# Altium project UNIREL_POT.PrjPcb
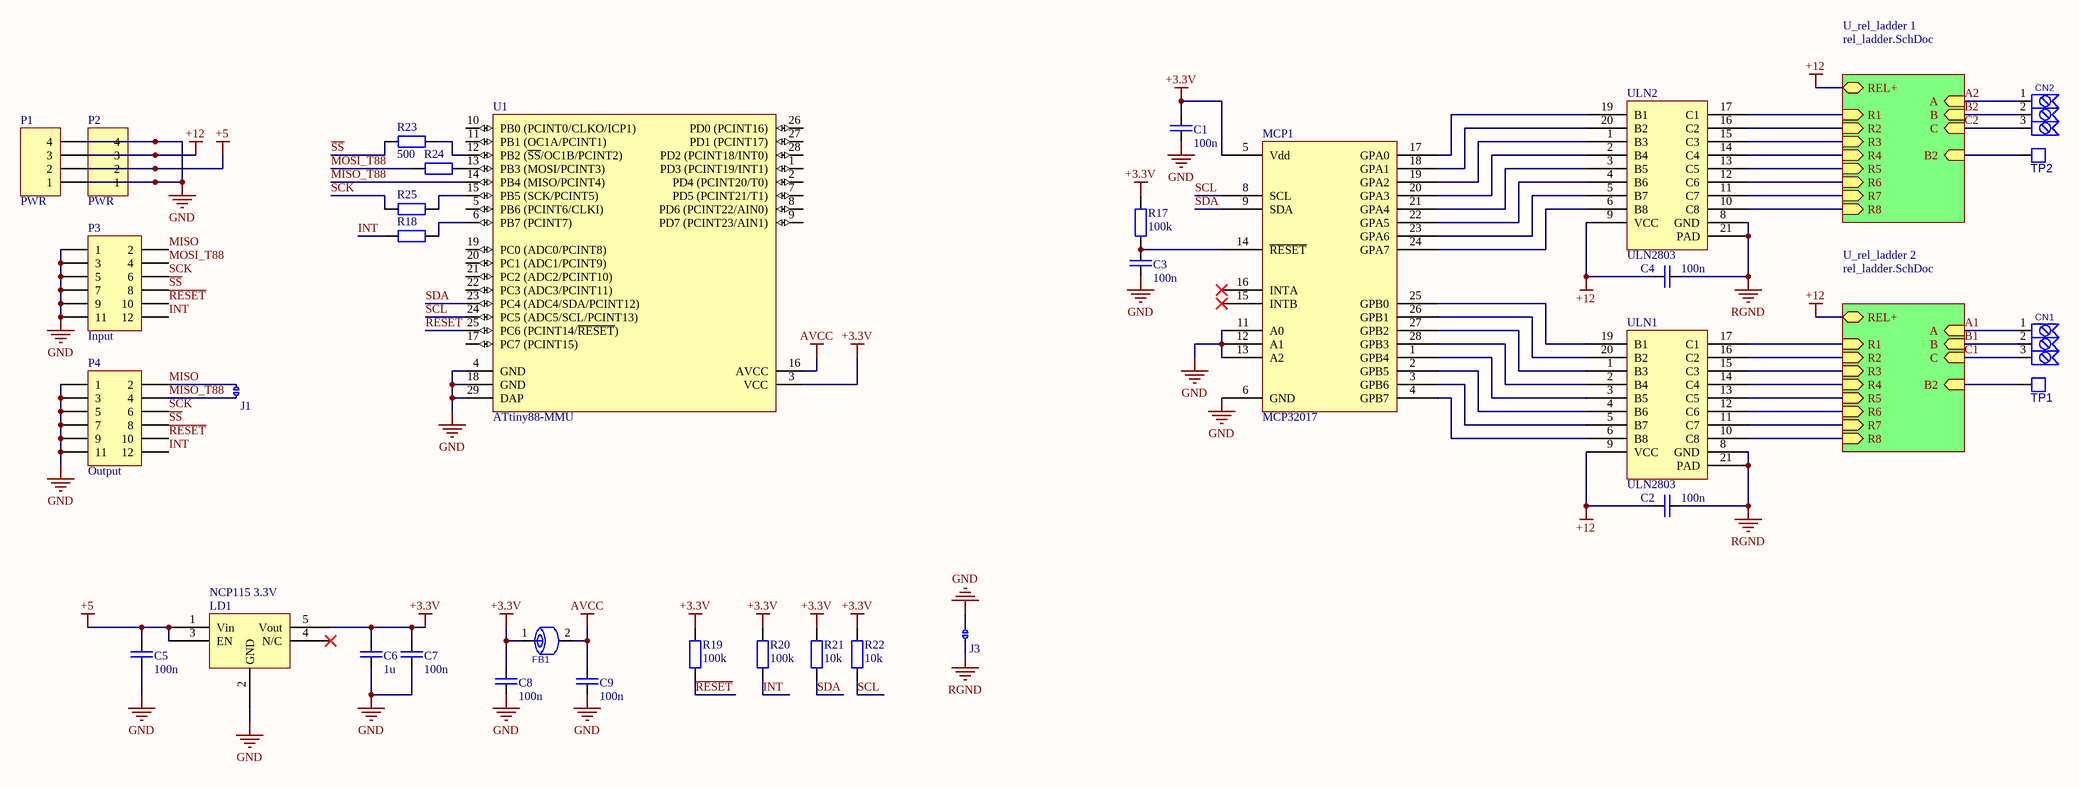
[diagram p0: POT 2x8.SchDoc]
3 sheets, 409 parts. Net scope: hierarchical (ports join the sheet entries above them; power ports are global).
Board files: POT 2x8.PcbDoc, POT 10x8.PcbDoc
Sheets:
  POT 2x8.SchDoc
    U_rel_ladder 1 = rel_ladder.SchDoc
    U_rel_ladder 2 = rel_ladder.SchDoc
  POT 10x8.SchDoc
    U_rel_ladder1 = rel_ladder.SchDoc
    U_rel_ladder2 = rel_ladder.SchDoc
    U_rel_ladder3 = rel_ladder.SchDoc
    U_rel_ladder4 = rel_ladder.SchDoc
    U_rel_ladder5 = rel_ladder.SchDoc
    U_rel_ladder6 = rel_ladder.SchDoc
    U_rel_ladder7 = rel_ladder.SchDoc
    U_rel_ladder8 = rel_ladder.SchDoc
    U_rel_ladder9 = rel_ladder.SchDoc
    U_rel_ladder10 = rel_ladder.SchDoc

## Sheet POT 2x8.SchDoc
size C

### Parts
C1  100n  [R1005_0402i_L]
C2  100n  [R1005_0402i_L]
C3  100n  [R1005_0402i_L]
C4  100n  [R1005_0402i_L]
C5  100n  [R1005_0402i_L]
C6  1u  [C1608_0603I_L]
C7  100n  [R1005_0402i_L]
C8  100n  [R1005_0402i_L]
C9  100n  [R1005_0402i_L]
CN1  VRSTNA SPONKA 3P/16A  [VRSTNA SPONKA 3P/16A]  (value not drawn)
CN2  VRSTNA SPONKA 3P/16A  [VRSTNA SPONKA 3P/16A]  (value not drawn)
FB1  FERITTE BEAD  [R1608_0603I_L]  (value not drawn)
J1  Terminator  [solderJumper]  (value not drawn)
J3  JMP_mini  [solderJumper]  (value not drawn)
LD1  NCP115 3.3V  [TSOP95P280X110-6L]
MCP1  MCP32017  [MCP23017 QFN]
P1  PWR  [HDR1X4]
P2  PWR  [HDR1X4]
P3  Input  [1.27mm SMD conn]
P4  Output  [1.27mm SMD conn]
R17  100k  [R1005_0402i_L]
R18  500  [R1005_0402i_L]  (value not drawn)
R19  100k  [R1005_0402i_L]
R20  100k  [R1005_0402i_L]
R21  10k  [R1005_0402i_L]
R22  10k  [R1005_0402i_L]
R23  500  [R1005_0402i_L]
R24  500  [R1005_0402i_L]  (value not drawn)
R25  500  [R1005_0402i_L]  (value not drawn)
TP1  PAD  [PAD_CIRC_HOLE]  (value not drawn)
TP2  PAD  [PAD_CIRC_HOLE]  (value not drawn)
U1  ATtiny88-MMU  [28M1_N]
ULN1  ULN2803  [QFN127P600-8N]
ULN2  ULN2803  [QFN127P600-8N]

### Sub-sheets
U_rel_ladder 1 = rel_ladder.SchDoc: B (in), C (in), A (in), REL+ (bidir), R1 (in), R2 (in), R3 (in), R4 (in), R5 (in), R6 (in), R7 (in), R8 (in), B2 (in)
U_rel_ladder 2 = rel_ladder.SchDoc: B (in), C (in), A (in), REL+ (bidir), R1 (in), R2 (in), R3 (in), R4 (in), R5 (in), R6 (in), R7 (in), R8 (in), B2 (in)

### Nets
+3.3V: C1.2 C6.1 C7.1 C8.1 FB1.1 LD1.5(Vout) MCP1.5(Vdd) R17.1 R19.1 R20.1 R21.1 R22.1 U1.3(VCC)
+5: C5.1 LD1.1(Vin) LD1.3(EN) P1.2 P2.2
+12: C2.1 C4.1 P1.3 P2.3 ULN1.9(VCC) ULN2.9(VCC) ; sheet U_rel_ladder 1/REL+, sheet U_rel_ladder 2/REL+
AVCC: C9.1 FB1.2 U1.16(AVCC)
GND: C1.1 C2.2 C3.1 C4.2 C5.2 C6.2 C7.2 C8.2 C9.2 J3.1 J3.2 LD1.2(GND) MCP1.6(GND) MCP1.11(A0) MCP1.12(A1) MCP1.13(A2) P1.1 P1.4 P2.1 P2.4 P3.1 P3.3 P3.5 P3.7 P3.9 P3.11 P4.1 P4.3 P4.5 P4.7 P4.9 P4.11 U1.4(GND) U1.18(GND) U1.29(DAP) ULN1.8(GND) ULN1.21(PAD) ULN2.8(GND) ULN2.21(PAD)  [also labelled RGND]
A1: CN1.1 ; sheet U_rel_ladder 2/A
A2: CN2.1 ; sheet U_rel_ladder 1/A
B1: CN1.2 TP1.1 ; sheet U_rel_ladder 2/B, sheet U_rel_ladder 2/B2
B2: CN2.2 TP2.1 ; sheet U_rel_ladder 1/B, sheet U_rel_ladder 1/B2
C1: CN1.3 ; sheet U_rel_ladder 2/C
C2: CN2.3 ; sheet U_rel_ladder 1/C
INT: P3.12 P4.12 R18.1 R20.2
MISO: J1.2 P3.2 P4.2
MISO_T88: J1.1 P4.4 U1.14(PB4_(MISO/PCINT4))
MOSI_T88: P3.4 R24.1
~{RESET}: P3.10 P4.10 R19.2 U1.25(PC6_(PCINT14/~{RESET}))
~{SS}: P3.8 P4.8 R23.1
SCK: P3.6 P4.6 R25.1
SCL: MCP1.8(SCL) R22.2 U1.24(PC5_(ADC5/SCL/PCINT13))
SDA: MCP1.9(SDA) R21.2 U1.23(PC4_(ADC4/SDA/PCINT12))
NetC3_2: C3.2 MCP1.14(~{RESET}) R17.2
NetK1_U_rel_ladder8_8: ULN1.17(C1) ; sheet U_rel_ladder 2/R1
NetK1_U_rel_ladder10#1_8: ULN2.17(C1) ; sheet U_rel_ladder 1/R1
NetK2_U_rel_ladder8_8: ULN1.16(C2) ; sheet U_rel_ladder 2/R2
NetK2_U_rel_ladder10#1_8: ULN2.16(C2) ; sheet U_rel_ladder 1/R2
NetK3_U_rel_ladder8_8: ULN1.15(C3) ; sheet U_rel_ladder 2/R3
NetK3_U_rel_ladder10#1_8: ULN2.15(C3) ; sheet U_rel_ladder 1/R3
NetK4_U_rel_ladder8_8: ULN1.14(C4) ; sheet U_rel_ladder 2/R4
NetK4_U_rel_ladder10#1_8: ULN2.14(C4) ; sheet U_rel_ladder 1/R4
NetK5_U_rel_ladder8_8: ULN1.13(C5) ; sheet U_rel_ladder 2/R5
NetK5_U_rel_ladder10#1_8: ULN2.13(C5) ; sheet U_rel_ladder 1/R5
NetK6_U_rel_ladder8_8: ULN1.12(C6) ; sheet U_rel_ladder 2/R6
NetK6_U_rel_ladder10#1_8: ULN2.12(C6) ; sheet U_rel_ladder 1/R6
NetK7_U_rel_ladder8_8: ULN1.11(C7) ; sheet U_rel_ladder 2/R7
NetK7_U_rel_ladder10#1_8: ULN2.11(C7) ; sheet U_rel_ladder 1/R7
NetK8_U_rel_ladder8_8: ULN1.10(C8) ; sheet U_rel_ladder 2/R8
NetK8_U_rel_ladder10#1_8: ULN2.10(C8) ; sheet U_rel_ladder 1/R8
NetMCP1_1: MCP1.1(GPB4) ULN1.3(B5)
NetMCP1_2: MCP1.2(GPB5) ULN1.4(B6)
NetMCP1_3: MCP1.3(GPB6) ULN1.5(B7)
NetMCP1_4: MCP1.4(GPB7) ULN1.6(B8)
NetMCP1_17: MCP1.17(GPA0) ULN2.19(B1)
NetMCP1_18: MCP1.18(GPA1) ULN2.20(B2)
NetMCP1_19: MCP1.19(GPA2) ULN2.1(B3)
NetMCP1_20: MCP1.20(GPA3) ULN2.2(B4)
NetMCP1_21: MCP1.21(GPA4) ULN2.3(B5)
NetMCP1_22: MCP1.22(GPA5) ULN2.4(B6)
NetMCP1_23: MCP1.23(GPA6) ULN2.5(B7)
NetMCP1_24: MCP1.24(GPA7) ULN2.6(B8)
NetMCP1_25: MCP1.25(GPB0) ULN1.19(B1)
NetMCP1_26: MCP1.26(GPB1) ULN1.20(B2)
NetMCP1_27: MCP1.27(GPB2) ULN1.1(B3)
NetMCP1_28: MCP1.28(GPB3) ULN1.2(B4)
NetR18_2: R18.2 U1.6(PB7_(PCINT7))
NetR23_2: R23.2 U1.12(PB2_(~{SS}/OC1B/PCINT2))
NetR24_2: R24.2 U1.13(PB3_(MOSI/PCINT3))
NetR25_2: R25.2 U1.15(PB5_(SCK/PCINT5))

Not connected (* = marked no-connect by the designer): LD1 4(N/C)*; MCP1 15(INTB)* 16(INTA)*; U1 1(PD3_(PCINT19/INT1)) 2(PD4_(PCINT20/T0)) 5(PB6_(PCINT6/CLKI)) 7(PD5_(PCINT21/T1)) 8(PD6_(PCINT22/AIN0)) 9(PD7_(PCINT23/AIN1)) 10(PB0_(PCINT0/CLKO/ICP1)) 11(PB1_(OC1A/PCINT1)) 17(PC7_(PCINT15)) 19(PC0_(ADC0/PCINT8)) 20(PC1_(ADC1/PCINT9)) 21(PC2_(ADC2/PCINT10)) 22(PC3_(ADC3/PCINT11)) 26(PD0_(PCINT16)) 27(PD1_(PCINT17)) 28(PD2_(PCINT18/INT0))

### Notes on the sheet
- Title
- Size:
- Date:
- File:
- C
- Number:
- Time:
- Revision:
- Sheet
- of

### Library data of the parts
C1-C9 = C: Capacitor
J1 = JMP_mini
P1 P2 = Header 4: Header, 4-Pin; LatestRevisionDate: 17-Jul-2002; LatestRevisionNote: Re-released for DXP Platform.; Publisher: Altium Limited
P3 P4 = Header 6X2: Header, 6-Pin, Dual row; LatestRevisionDate: 17-Jul-2002; LatestRevisionNote: Re-released for DXP Platform.; Publisher: Altium Limited
R17-R25 = R
U1 = ATtiny88-MMU: 8-bit AVR Microcontroller, 1.8-5.5V, 8KB Flash, 64 Bytes EEPROM, 512 Bytes SRAM, 28-pin MLF, Industrial Grade (-40°C to 85°C), Pb-Free; Published: 1-Apr-2010; DatasheetVersion: revC, Mar-2009; PackageVersion: revB, Nov-2008; PackageReference: 28M1; Publisher: Altium Limited; PackageDescription: 28-pad, 4x4x1.0mm Body, Pitch 0.45mm, 2.4x2.4mm Exposed Pad, Plastic Very Thin QFN Package (VQFN); Supplier 1: Digi-Key; Supplier Part Number 1: ATTINY88-MMU-ND; Supplier 2: Mouser; Supplier Part Number 2: 556-ATTINY88-MMU; ComponentLink1Description: Manufacturer Link; ComponentLink1URL: http://www.atmel.com/products/avr/default.asp?; ComponentLink2Description: ATtiny48/88 Datasheet; ComponentLink2URL: http://www.atmel.com/dyn/resources/prod_documents/doc8008.pdf; ComponentLink3Description: ATtiny48/88 Summary; ComponentLink3URL: http://www.atmel.com/dyn/resources/prod_documents/8008S.pdf; ComponentLink4Description: Atmel.com Home; ComponentLink4URL: http://www.atmel.com
CN1 CN2 = VRSTNA SPONKA 3P/16A: Value: *

## Sheet rel_ladder.SchDoc
size A4
Used 12 times, as channels U_rel_ladder 1, U_rel_ladder 2, U_rel_ladder1, U_rel_ladder2, U_rel_ladder3, U_rel_ladder4, U_rel_ladder5, U_rel_ladder6, U_rel_ladder7, U_rel_ladder8, U_rel_ladder9, U_rel_ladder10. Parts and nets are listed once, with the designators drawn on the sheet.
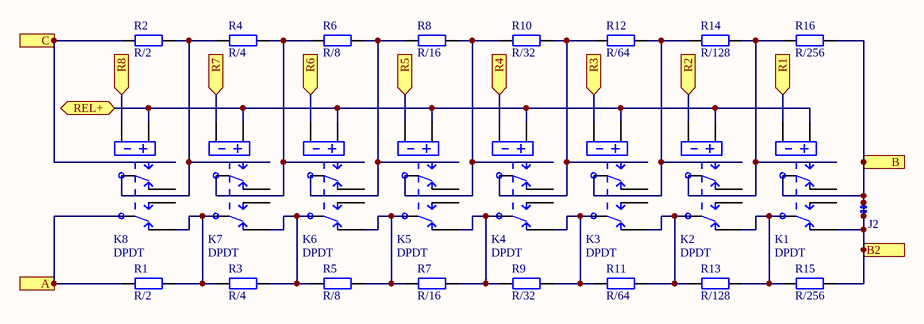
[diagram p1: rel_ladder.SchDoc]

### Parts
J2  JMP_mini  [solderJumper]  (value not drawn)
K1  DPDT  [AXICOM IM-G Relay]
K2  DPDT  [AXICOM IM-G Relay]
K3  DPDT  [AXICOM IM-G Relay]
K4  DPDT  [AXICOM IM-G Relay]
K5  DPDT  [AXICOM IM-G Relay]
K6  DPDT  [AXICOM IM-G Relay]
K7  DPDT  [AXICOM IM-G Relay]
K8  DPDT  [AXICOM IM-G Relay]
R1  R/2  [R2012_0805I_L]
R2  R/2  [R2012_0805I_L]
R3  R/4  [R2012_0805I_L]
R4  R/4  [R2012_0805I_L]
R5  R/8  [R2012_0805I_L]
R6  R/8  [R2012_0805I_L]
R7  R/16  [R2012_0805I_L]
R8  R/16  [R2012_0805I_L]
R9  R/32  [R2012_0805I_L]
R10  R/32  [R2012_0805I_L]
R11  R/64  [R2012_0805I_L]
R12  R/64  [R2012_0805I_L]
R13  R/128  [R2012_0805I_L]
R14  R/128  [R2012_0805I_L]
R15  R/256  [R2012_0805I_L]
R16  R/256  [R2012_0805I_L]

### Ports
A (in), B2 (in), B (in), C (in), R1 (in), R2 (in), R3 (in), R4 (in), R5 (in), R6 (in), R7 (in), R8 (in), REL+ (bidir)

### Nets
A: K8.6 R1.1 ; port A
B: J2.1 J2.2 K1.3 K1.7 R15.2 R16.2 ; port B, port B2
C: K8.4 R2.1 ; port C
R1: K1.8 ; port R1
R2: K2.8 ; port R2
R3: K3.8 ; port R3
R4: K4.8 ; port R4
R5: K5.8 ; port R5
R6: K6.8 ; port R6
R7: K7.8 ; port R7
R8: K8.8 ; port R8
REL+: K1.1 K2.1 K3.1 K4.1 K5.1 K6.1 K7.1 K8.1 ; port REL+
NetK1_4: K1.4 K2.3 R14.2 R16.1
NetK1_6: K1.6 K2.7 R13.2 R15.1
NetK2_4: K2.4 K3.3 R12.2 R14.1
NetK2_6: K2.6 K3.7 R11.2 R13.1
NetK3_4: K3.4 K4.3 R10.2 R12.1
NetK3_6: K3.6 K4.7 R9.2 R11.1
NetK4_4: K4.4 K5.3 R8.2 R10.1
NetK4_6: K4.6 K5.7 R7.2 R9.1
NetK5_4: K5.4 K6.3 R6.2 R8.1
NetK5_6: K5.6 K6.7 R5.2 R7.1
NetK6_4: K6.4 K7.3 R4.2 R6.1
NetK6_6: K6.6 K7.7 R3.2 R5.1
NetK7_4: K7.4 K8.3 R2.2 R4.1
NetK7_6: K7.6 K8.7 R1.2 R3.1

Not connected (* = marked no-connect by the designer): K1 2 5; K2 2 5; K3 2 5; K4 2 5; K5 2 5; K6 2 5; K7 2 5; K8 2 5

### Channels
U_rel_ladder 1: designators end in _U_rel_ladder10#1; ports A=A2 B2=B2 B=B2 C=C2 R1=NetK1_U_rel_ladder10#1_8 R2=NetK2_U_rel_ladder10#1_8 R3=NetK3_U_rel_ladder10#1_8 R4=NetK4_U_rel_ladder10#1_8 R5=NetK5_U_rel_ladder10#1_8 R6=NetK6_U_rel_ladder10#1_8 R7=NetK7_U_rel_ladder10#1_8 R8=NetK8_U_rel_ladder10#1_8 REL+=+12
U_rel_ladder 2: designators end in _U_rel_ladder8; ports A=A1 B2=B1 B=B1 C=C1 R1=NetK1_U_rel_ladder8_8 R2=NetK2_U_rel_ladder8_8 R3=NetK3_U_rel_ladder8_8 R4=NetK4_U_rel_ladder8_8 R5=NetK5_U_rel_ladder8_8 R6=NetK6_U_rel_ladder8_8 R7=NetK7_U_rel_ladder8_8 R8=NetK8_U_rel_ladder8_8 REL+=+12
U_rel_ladder1: designators end in _U_rel_ladder7; ports A=A1 B2=B1 B=B1 C=C1 R1=NetK1_U_rel_ladder7_8 R2=NetK2_U_rel_ladder7_8 R3=NetK3_U_rel_ladder7_8 R4=NetK4_U_rel_ladder7_8 R5=NetK5_U_rel_ladder7_8 R6=NetK6_U_rel_ladder7_8 R7=NetK7_U_rel_ladder7_8 R8=NetK8_U_rel_ladder7_8 REL+=+12
U_rel_ladder2: designators end in _U_rel_ladder6; ports A=A2 B2=B2 B=B2 C=C2 R1=NetK1_U_rel_ladder6_8 R2=NetK2_U_rel_ladder6_8 R3=NetK3_U_rel_ladder6_8 R4=NetK4_U_rel_ladder6_8 R5=NetK5_U_rel_ladder6_8 R6=NetK6_U_rel_ladder6_8 R7=NetK7_U_rel_ladder6_8 R8=NetK8_U_rel_ladder6_8 REL+=+12
U_rel_ladder3: designators end in _U_rel_ladder9#1; ports A=A3 B2=B3 B=B3 C=C3 R1=NetK1_U_rel_ladder9#1_8 R2=NetK2_U_rel_ladder9#1_8 R3=NetK3_U_rel_ladder9#1_8 R4=NetK4_U_rel_ladder9#1_8 R5=NetK5_U_rel_ladder9#1_8 R6=NetK6_U_rel_ladder9#1_8 R7=NetK7_U_rel_ladder9#1_8 R8=NetK8_U_rel_ladder9#1_8 REL+=+12
U_rel_ladder4: designators end in _U_rel_ladder5; ports A=A4 B2=B4 B=B4 C=C4 R1=NetK1_U_rel_ladder5_8 R2=NetK2_U_rel_ladder5_8 R3=NetK3_U_rel_ladder5_8 R4=NetK4_U_rel_ladder5_8 R5=NetK5_U_rel_ladder5_8 R6=NetK6_U_rel_ladder5_8 R7=NetK7_U_rel_ladder5_8 R8=NetK8_U_rel_ladder5_8 REL+=+12
U_rel_ladder5: designators end in _U_rel_ladder4; ports A=A5 B2=B5 B=B5 C=C5 R1=NetK1_U_rel_ladder4_8 R2=NetK2_U_rel_ladder4_8 R3=NetK3_U_rel_ladder4_8 R4=NetK4_U_rel_ladder4_8 R5=NetK5_U_rel_ladder4_8 R6=NetK6_U_rel_ladder4_8 R7=NetK7_U_rel_ladder4_8 R8=NetK8_U_rel_ladder4_8 REL+=+12
U_rel_ladder6: designators end in _U_rel_ladder3; ports A=A6 B2=B6 B=B6 C=C6 R1=NetK1_U_rel_ladder3_8 R2=NetK2_U_rel_ladder3_8 R3=NetK3_U_rel_ladder3_8 R4=NetK4_U_rel_ladder3_8 R5=NetK5_U_rel_ladder3_8 R6=NetK6_U_rel_ladder3_8 R7=NetK7_U_rel_ladder3_8 R8=NetK8_U_rel_ladder3_8 REL+=+12
U_rel_ladder7: designators end in _U_rel_ladder2; ports A=A7 B2=B7 B=B7 C=C7 R1=NetK1_U_rel_ladder2_8 R2=NetK2_U_rel_ladder2_8 R3=NetK3_U_rel_ladder2_8 R4=NetK4_U_rel_ladder2_8 R5=NetK5_U_rel_ladder2_8 R6=NetK6_U_rel_ladder2_8 R7=NetK7_U_rel_ladder2_8 R8=NetK8_U_rel_ladder2_8 REL+=+12
U_rel_ladder8: designators end in _U_rel_ladder1; ports A=A8 B2=B8 B=B8 C=C8 R1=NetK1_U_rel_ladder1_8 R2=NetK2_U_rel_ladder1_8 R3=NetK3_U_rel_ladder1_8 R4=NetK4_U_rel_ladder1_8 R5=NetK5_U_rel_ladder1_8 R6=NetK6_U_rel_ladder1_8 R7=NetK7_U_rel_ladder1_8 R8=NetK8_U_rel_ladder1_8 REL+=+12
U_rel_ladder9: designators end in _U_rel_ladder9#2; ports A=A9 B2=B9 B=B9 C=C9 R1=NetK1_U_rel_ladder9#2_8 R2=NetK2_U_rel_ladder9#2_8 R3=NetK3_U_rel_ladder9#2_8 R4=NetK4_U_rel_ladder9#2_8 R5=NetK5_U_rel_ladder9#2_8 R6=NetK6_U_rel_ladder9#2_8 R7=NetK7_U_rel_ladder9#2_8 R8=NetK8_U_rel_ladder9#2_8 REL+=+12
U_rel_ladder10: designators end in _U_rel_ladder10#2; ports A=A10 B2=B10 B=B10 C=C10 R1=NetK1_U_rel_ladder10#2_8 R2=NetK2_U_rel_ladder10#2_8 R3=NetK3_U_rel_ladder10#2_8 R4=NetK4_U_rel_ladder10#2_8 R5=NetK5_U_rel_ladder10#2_8 R6=NetK6_U_rel_ladder10#2_8 R7=NetK7_U_rel_ladder10#2_8 R8=NetK8_U_rel_ladder10#2_8 REL+=+12

### Library data of the parts
K1-K8 = IM-GR Relay DPDT: TE CONNECTIVITY  IM-GR  RELAY, DPDT, NO; Farnell ID: 1175070; URL: http://si.farnell.com/te-connectivity-axicom/im06gr/relay-gull-wing-dpco-12vdc-2a/dp/1175070
R1-R16 = R

## Sheet POT 10x8.SchDoc
size D
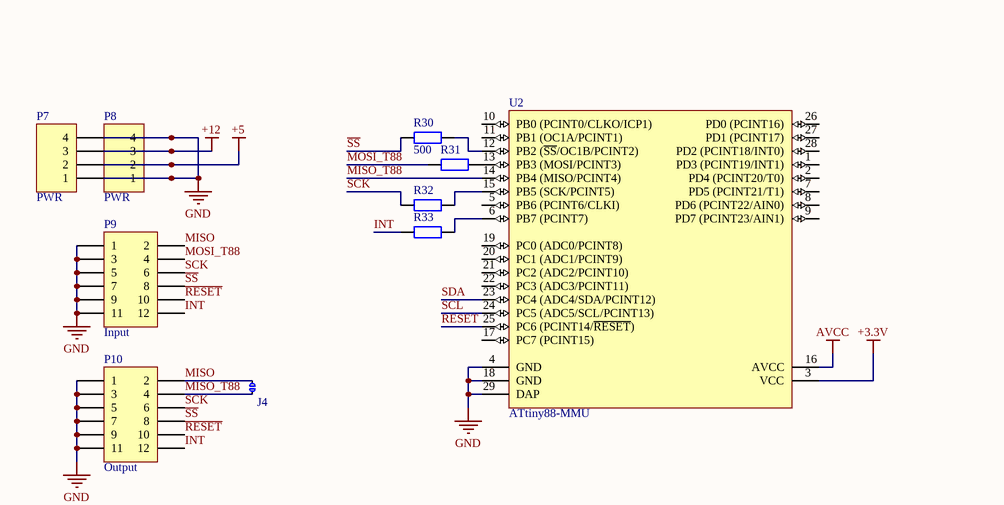
[diagram p2: POT 10x8.SchDoc, top left]
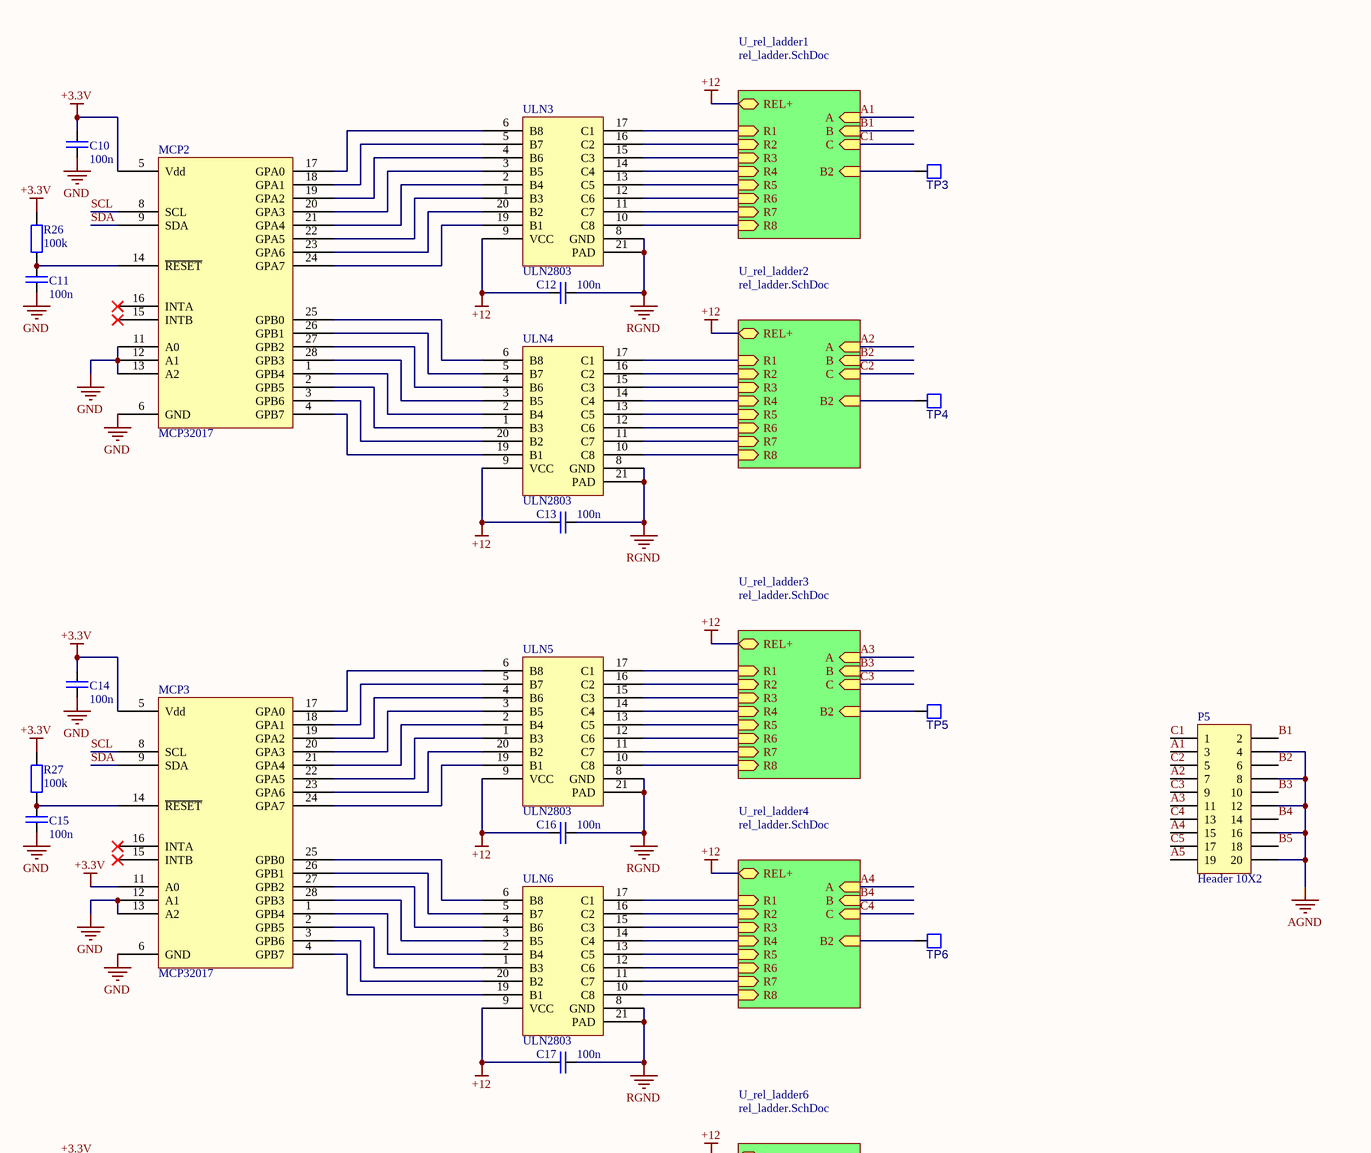
[diagram p3: POT 10x8.SchDoc, top right]
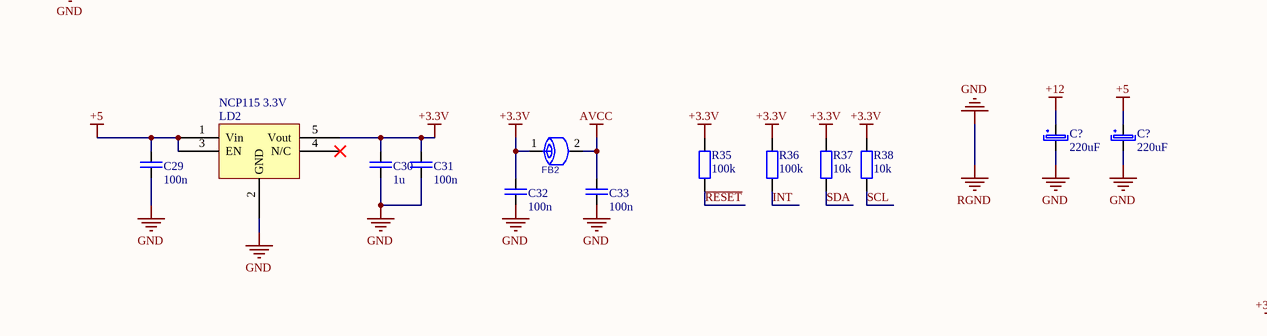
[diagram p4: POT 10x8.SchDoc, bottom left]
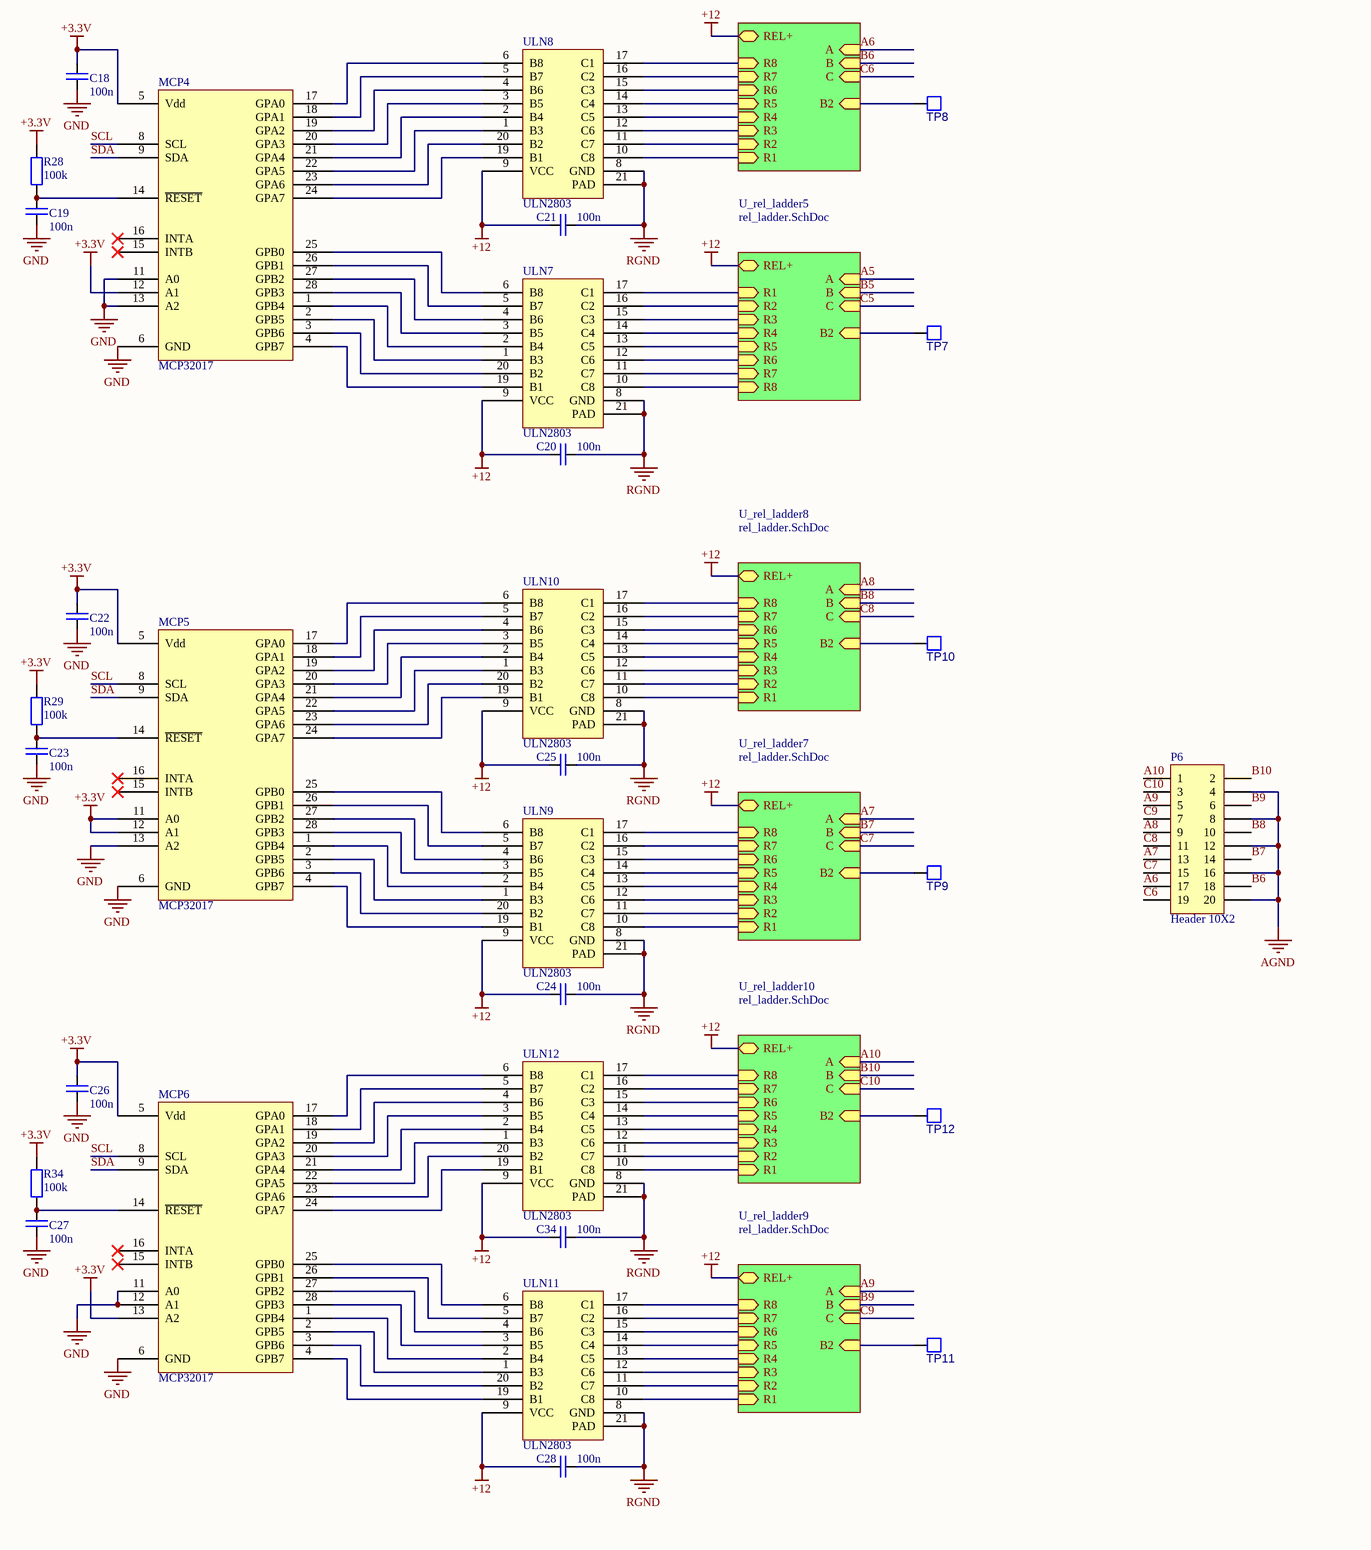
[diagram p5: POT 10x8.SchDoc, bottom right]

### Parts
(Parts that share a designator on the sheet are numbered #1, #2 ... from top to bottom, then left to right.)
C10  100n  [R1005_0402i_L]
C11  100n  [R1005_0402i_L]
C12  100n  [R1005_0402i_L]
C13  100n  [R1005_0402i_L]
C14  100n  [R1005_0402i_L]
C15  100n  [R1005_0402i_L]
C16  100n  [R1005_0402i_L]
C17  100n  [R1005_0402i_L]
C18  100n  [R1005_0402i_L]
C19  100n  [R1005_0402i_L]
C20  100n  [R1005_0402i_L]
C21  100n  [R1005_0402i_L]
C22  100n  [R1005_0402i_L]
C23  100n  [R1005_0402i_L]
C24  100n  [R1005_0402i_L]
C25  100n  [R1005_0402i_L]
C26  100n  [R1005_0402i_L]
C27  100n  [R1005_0402i_L]
C28  100n  [R1005_0402i_L]
C29  100n  [R1005_0402i_L]
C30  1u  [C1608_0603I_L]
C31  100n  [R1005_0402i_L]
C32  100n  [R1005_0402i_L]
C33  100n  [R1005_0402i_L]
C34  100n  [R1005_0402i_L]
C?#1  220uF  [C AlElko 5x11 R2]
C?#2  220uF  [C AlElko 5x11 R2]
FB2  FERITTE BEAD  [R1608_0603I_L]  (value not drawn)
J4  Terminator  [solderJumper]  (value not drawn)
LD2  NCP115 3.3V  [TSOP95P280X110-6L]
MCP2  MCP32017  [MCP23017 QFN]
MCP3  MCP32017  [MCP23017 QFN]
MCP4  MCP32017  [MCP23017 QFN]
MCP5  MCP32017  [MCP23017 QFN]
MCP6  MCP32017  [MCP23017 QFN]
P5  Header 10X2  [HDR2X10]
P6  Header 10X2  [HDR2X10]
P7  PWR  [HDR1X4]
P8  PWR  [HDR1X4]
P9  Input  [1.27mm SMD conn]
P10  Output  [1.27mm SMD conn]
R26  100k  [R1005_0402i_L]
R27  100k  [R1005_0402i_L]
R28  100k  [R1005_0402i_L]
R29  100k  [R1005_0402i_L]
R30  500  [R1005_0402i_L]
R31  500  [R1005_0402i_L]  (value not drawn)
R32  500  [R1005_0402i_L]  (value not drawn)
R33  500  [R1005_0402i_L]  (value not drawn)
R34  100k  [R1005_0402i_L]
R35  100k  [R1005_0402i_L]
R36  100k  [R1005_0402i_L]
R37  10k  [R1005_0402i_L]
R38  10k  [R1005_0402i_L]
TP3  PAD  [PAD_CIRC_HOLE]  (value not drawn)
TP4  PAD  [PAD_CIRC_HOLE]  (value not drawn)
TP5  PAD  [PAD_CIRC_HOLE]  (value not drawn)
TP6  PAD  [PAD_CIRC_HOLE]  (value not drawn)
TP7  PAD  [PAD_CIRC_HOLE]  (value not drawn)
TP8  PAD  [PAD_CIRC_HOLE]  (value not drawn)
TP9  PAD  [PAD_CIRC_HOLE]  (value not drawn)
TP10  PAD  [PAD_CIRC_HOLE]  (value not drawn)
TP11  PAD  [PAD_CIRC_HOLE]  (value not drawn)
TP12  PAD  [PAD_CIRC_HOLE]  (value not drawn)
U2  ATtiny88-MMU  [28M1_N]
ULN3  ULN2803  [QFN127P600-8N]
ULN4  ULN2803  [QFN127P600-8N]
ULN5  ULN2803  [QFN127P600-8N]
ULN6  ULN2803  [QFN127P600-8N]
ULN7  ULN2803  [QFN127P600-8N]
ULN8  ULN2803  [QFN127P600-8N]
ULN9  ULN2803  [QFN127P600-8N]
ULN10  ULN2803  [QFN127P600-8N]
ULN11  ULN2803  [QFN127P600-8N]
ULN12  ULN2803  [QFN127P600-8N]

### Sub-sheets
U_rel_ladder1 = rel_ladder.SchDoc: B (in), C (in), A (in), REL+ (bidir), R1 (in), R2 (in), R3 (in), R4 (in), R5 (in), R6 (in), R7 (in), R8 (in), B2 (in)
U_rel_ladder2 = rel_ladder.SchDoc: B (in), C (in), A (in), REL+ (bidir), R1 (in), R2 (in), R3 (in), R4 (in), R5 (in), R6 (in), R7 (in), R8 (in), B2 (in)
U_rel_ladder3 = rel_ladder.SchDoc: B (in), C (in), A (in), REL+ (bidir), R1 (in), R2 (in), R3 (in), R4 (in), R5 (in), R6 (in), R7 (in), R8 (in), B2 (in)
U_rel_ladder4 = rel_ladder.SchDoc: B (in), C (in), A (in), REL+ (bidir), R1 (in), R2 (in), R3 (in), R4 (in), R5 (in), R6 (in), R7 (in), R8 (in), B2 (in)
U_rel_ladder5 = rel_ladder.SchDoc: B (in), C (in), A (in), REL+ (bidir), R1 (in), R2 (in), R3 (in), R4 (in), R5 (in), R6 (in), R7 (in), R8 (in), B2 (in)
U_rel_ladder6 = rel_ladder.SchDoc: B (in), C (in), A (in), REL+ (bidir), R1 (in), R2 (in), R3 (in), R4 (in), R5 (in), R6 (in), R7 (in), R8 (in), B2 (in)
U_rel_ladder7 = rel_ladder.SchDoc: B (in), C (in), A (in), REL+ (bidir), R1 (in), R2 (in), R3 (in), R4 (in), R5 (in), R6 (in), R7 (in), R8 (in), B2 (in)
U_rel_ladder8 = rel_ladder.SchDoc: B (in), C (in), A (in), REL+ (bidir), R1 (in), R2 (in), R3 (in), R4 (in), R5 (in), R6 (in), R7 (in), R8 (in), B2 (in)
U_rel_ladder9 = rel_ladder.SchDoc: B (in), C (in), A (in), REL+ (bidir), R1 (in), R2 (in), R3 (in), R4 (in), R5 (in), R6 (in), R7 (in), R8 (in), B2 (in)
U_rel_ladder10 = rel_ladder.SchDoc: B (in), C (in), A (in), REL+ (bidir), R1 (in), R2 (in), R3 (in), R4 (in), R5 (in), R6 (in), R7 (in), R8 (in), B2 (in)

### Nets
+3.3V: C10.2 C14.2 C18.2 C22.2 C26.2 C30.1 C31.1 C32.1 FB2.1 LD2.5(Vout) MCP2.5(Vdd) MCP3.5(Vdd) MCP3.11(A0) MCP4.5(Vdd) MCP4.12(A1) MCP5.5(Vdd) MCP5.11(A0) MCP5.12(A1) MCP6.5(Vdd) MCP6.13(A2) R26.1 R27.1 R28.1 R29.1 R34.1 R35.1 R36.1 R37.1 R38.1 U2.3(VCC)
+5: C29.1 C?#2.1 LD2.1(Vin) LD2.3(EN) P7.2 P8.2
+12: C12.1 C13.1 C16.1 C17.1 C20.1 C21.1 C24.1 C25.1 C28.1 C34.1 C?#1.1 P7.3 P8.3 ULN3.9(VCC) ULN4.9(VCC) ULN5.9(VCC) ULN6.9(VCC) ULN7.9(VCC) ULN8.9(VCC) ULN9.9(VCC) ULN10.9(VCC) ULN11.9(VCC) ULN12.9(VCC) ; sheet U_rel_ladder1/REL+, sheet U_rel_ladder2/REL+, sheet U_rel_ladder3/REL+, sheet U_rel_ladder4/REL+, sheet U_rel_ladder5/REL+, sheet U_rel_ladder6/REL+, sheet U_rel_ladder7/REL+, sheet U_rel_ladder8/REL+, sheet U_rel_ladder9/REL+, sheet U_rel_ladder10/REL+
AGND: P5.4 P5.8 P5.12 P5.16 P5.20 P6.4 P6.8 P6.12 P6.16 P6.20
AVCC: C33.1 FB2.2 U2.16(AVCC)
GND: C10.1 C11.1 C12.2 C13.2 C14.1 C15.1 C16.2 C17.2 C18.1 C19.1 C20.2 C21.2 C22.1 C23.1 C24.2 C25.2 C26.1 C27.1 C28.2 C29.2 C30.2 C31.2 C32.2 C33.2 C34.2 C?#1.2 C?#2.2 LD2.2(GND) MCP2.6(GND) MCP2.11(A0) MCP2.12(A1) MCP2.13(A2) MCP3.6(GND) MCP3.12(A1) MCP3.13(A2) MCP4.6(GND) MCP4.11(A0) MCP4.13(A2) MCP5.6(GND) MCP5.13(A2) MCP6.6(GND) MCP6.11(A0) MCP6.12(A1) P7.1 P7.4 P8.1 P8.4 P9.1 P9.3 P9.5 P9.7 P9.9 P9.11 P10.1 P10.3 P10.5 P10.7 P10.9 P10.11 U2.4(GND) U2.18(GND) U2.29(DAP) ULN3.8(GND) ULN3.21(PAD) ULN4.8(GND) ULN4.21(PAD) ULN5.8(GND) ULN5.21(PAD) ULN6.8(GND) ULN6.21(PAD) ULN7.8(GND) ULN7.21(PAD) ULN8.8(GND) ULN8.21(PAD) ULN9.8(GND) ULN9.21(PAD) ULN10.8(GND) ULN10.21(PAD) ULN11.8(GND) ULN11.21(PAD) ULN12.8(GND) ULN12.21(PAD)  [also labelled RGND]
A1: P5.3 ; sheet U_rel_ladder1/A
A2: P5.7 ; sheet U_rel_ladder2/A
A3: P5.11 ; sheet U_rel_ladder3/A
A4: P5.15 ; sheet U_rel_ladder4/A
A5: P5.19 ; sheet U_rel_ladder5/A
A6: P6.17 ; sheet U_rel_ladder6/A
A7: P6.13 ; sheet U_rel_ladder7/A
A8: P6.9 ; sheet U_rel_ladder8/A
A9: P6.5 ; sheet U_rel_ladder9/A
A10: P6.1 ; sheet U_rel_ladder10/A
B1: P5.2 TP3.1 ; sheet U_rel_ladder1/B, sheet U_rel_ladder1/B2
B2: P5.6 TP4.1 ; sheet U_rel_ladder2/B, sheet U_rel_ladder2/B2
B3: P5.10 TP5.1 ; sheet U_rel_ladder3/B, sheet U_rel_ladder3/B2
B4: P5.14 TP6.1 ; sheet U_rel_ladder4/B, sheet U_rel_ladder4/B2
B5: P5.18 TP7.1 ; sheet U_rel_ladder5/B, sheet U_rel_ladder5/B2
B6: P6.18 TP8.1 ; sheet U_rel_ladder6/B, sheet U_rel_ladder6/B2
B7: P6.14 TP9.1 ; sheet U_rel_ladder7/B, sheet U_rel_ladder7/B2
B8: P6.10 TP10.1 ; sheet U_rel_ladder8/B, sheet U_rel_ladder8/B2
B9: P6.6 TP11.1 ; sheet U_rel_ladder9/B, sheet U_rel_ladder9/B2
B10: P6.2 TP12.1 ; sheet U_rel_ladder10/B, sheet U_rel_ladder10/B2
C1: P5.1 ; sheet U_rel_ladder1/C
C2: P5.5 ; sheet U_rel_ladder2/C
C3: P5.9 ; sheet U_rel_ladder3/C
C4: P5.13 ; sheet U_rel_ladder4/C
C5: P5.17 ; sheet U_rel_ladder5/C
C6: P6.19 ; sheet U_rel_ladder6/C
C7: P6.15 ; sheet U_rel_ladder7/C
C8: P6.11 ; sheet U_rel_ladder8/C
C9: P6.7 ; sheet U_rel_ladder9/C
C10: P6.3 ; sheet U_rel_ladder10/C
INT: P9.12 P10.12 R33.1 R36.2
MISO: J4.2 P9.2 P10.2
MISO_T88: J4.1 P10.4 U2.14(PB4_(MISO/PCINT4))
MOSI_T88: P9.4 R31.1
~{RESET}: P9.10 P10.10 R35.2 U2.25(PC6_(PCINT14/~{RESET}))
~{SS}: P9.8 P10.8 R30.1
SCK: P9.6 P10.6 R32.1
SCL: MCP2.8(SCL) MCP3.8(SCL) MCP4.8(SCL) MCP5.8(SCL) MCP6.8(SCL) R38.2 U2.24(PC5_(ADC5/SCL/PCINT13))
SDA: MCP2.9(SDA) MCP3.9(SDA) MCP4.9(SDA) MCP5.9(SDA) MCP6.9(SDA) R37.2 U2.23(PC4_(ADC4/SDA/PCINT12))
NetC11_2: C11.2 MCP2.14(~{RESET}) R26.2
NetC15_2: C15.2 MCP3.14(~{RESET}) R27.2
NetC19_2: C19.2 MCP4.14(~{RESET}) R28.2
NetC23_2: C23.2 MCP5.14(~{RESET}) R29.2
NetC27_2: C27.2 MCP6.14(~{RESET}) R34.2
NetK1_U_rel_ladder1_8: ULN10.10(C8) ; sheet U_rel_ladder8/R1
NetK1_U_rel_ladder2_8: ULN9.10(C8) ; sheet U_rel_ladder7/R1
NetK1_U_rel_ladder3_8: ULN8.10(C8) ; sheet U_rel_ladder6/R1
NetK1_U_rel_ladder4_8: ULN7.17(C1) ; sheet U_rel_ladder5/R1
NetK1_U_rel_ladder5_8: ULN6.17(C1) ; sheet U_rel_ladder4/R1
NetK1_U_rel_ladder6_8: ULN4.17(C1) ; sheet U_rel_ladder2/R1
NetK1_U_rel_ladder7_8: ULN3.17(C1) ; sheet U_rel_ladder1/R1
NetK1_U_rel_ladder9#1_8: ULN5.17(C1) ; sheet U_rel_ladder3/R1
NetK1_U_rel_ladder9#2_8: ULN11.10(C8) ; sheet U_rel_ladder9/R1
NetK1_U_rel_ladder10#2_8: ULN12.10(C8) ; sheet U_rel_ladder10/R1
NetK2_U_rel_ladder1_8: ULN10.11(C7) ; sheet U_rel_ladder8/R2
NetK2_U_rel_ladder2_8: ULN9.11(C7) ; sheet U_rel_ladder7/R2
NetK2_U_rel_ladder3_8: ULN8.11(C7) ; sheet U_rel_ladder6/R2
NetK2_U_rel_ladder4_8: ULN7.16(C2) ; sheet U_rel_ladder5/R2
NetK2_U_rel_ladder5_8: ULN6.16(C2) ; sheet U_rel_ladder4/R2
NetK2_U_rel_ladder6_8: ULN4.16(C2) ; sheet U_rel_ladder2/R2
NetK2_U_rel_ladder7_8: ULN3.16(C2) ; sheet U_rel_ladder1/R2
NetK2_U_rel_ladder9#1_8: ULN5.16(C2) ; sheet U_rel_ladder3/R2
NetK2_U_rel_ladder9#2_8: ULN11.11(C7) ; sheet U_rel_ladder9/R2
NetK2_U_rel_ladder10#2_8: ULN12.11(C7) ; sheet U_rel_ladder10/R2
NetK3_U_rel_ladder1_8: ULN10.12(C6) ; sheet U_rel_ladder8/R3
NetK3_U_rel_ladder2_8: ULN9.12(C6) ; sheet U_rel_ladder7/R3
NetK3_U_rel_ladder3_8: ULN8.12(C6) ; sheet U_rel_ladder6/R3
NetK3_U_rel_ladder4_8: ULN7.15(C3) ; sheet U_rel_ladder5/R3
NetK3_U_rel_ladder5_8: ULN6.15(C3) ; sheet U_rel_ladder4/R3
NetK3_U_rel_ladder6_8: ULN4.15(C3) ; sheet U_rel_ladder2/R3
NetK3_U_rel_ladder7_8: ULN3.15(C3) ; sheet U_rel_ladder1/R3
NetK3_U_rel_ladder9#1_8: ULN5.15(C3) ; sheet U_rel_ladder3/R3
NetK3_U_rel_ladder9#2_8: ULN11.12(C6) ; sheet U_rel_ladder9/R3
NetK3_U_rel_ladder10#2_8: ULN12.12(C6) ; sheet U_rel_ladder10/R3
NetK4_U_rel_ladder1_8: ULN10.13(C5) ; sheet U_rel_ladder8/R4
NetK4_U_rel_ladder2_8: ULN9.13(C5) ; sheet U_rel_ladder7/R4
NetK4_U_rel_ladder3_8: ULN8.13(C5) ; sheet U_rel_ladder6/R4
NetK4_U_rel_ladder4_8: ULN7.14(C4) ; sheet U_rel_ladder5/R4
NetK4_U_rel_ladder5_8: ULN6.14(C4) ; sheet U_rel_ladder4/R4
NetK4_U_rel_ladder6_8: ULN4.14(C4) ; sheet U_rel_ladder2/R4
NetK4_U_rel_ladder7_8: ULN3.14(C4) ; sheet U_rel_ladder1/R4
NetK4_U_rel_ladder9#1_8: ULN5.14(C4) ; sheet U_rel_ladder3/R4
NetK4_U_rel_ladder9#2_8: ULN11.13(C5) ; sheet U_rel_ladder9/R4
NetK4_U_rel_ladder10#2_8: ULN12.13(C5) ; sheet U_rel_ladder10/R4
NetK5_U_rel_ladder1_8: ULN10.14(C4) ; sheet U_rel_ladder8/R5
NetK5_U_rel_ladder2_8: ULN9.14(C4) ; sheet U_rel_ladder7/R5
NetK5_U_rel_ladder3_8: ULN8.14(C4) ; sheet U_rel_ladder6/R5
NetK5_U_rel_ladder4_8: ULN7.13(C5) ; sheet U_rel_ladder5/R5
NetK5_U_rel_ladder5_8: ULN6.13(C5) ; sheet U_rel_ladder4/R5
NetK5_U_rel_ladder6_8: ULN4.13(C5) ; sheet U_rel_ladder2/R5
NetK5_U_rel_ladder7_8: ULN3.13(C5) ; sheet U_rel_ladder1/R5
NetK5_U_rel_ladder9#1_8: ULN5.13(C5) ; sheet U_rel_ladder3/R5
NetK5_U_rel_ladder9#2_8: ULN11.14(C4) ; sheet U_rel_ladder9/R5
NetK5_U_rel_ladder10#2_8: ULN12.14(C4) ; sheet U_rel_ladder10/R5
NetK6_U_rel_ladder1_8: ULN10.15(C3) ; sheet U_rel_ladder8/R6
NetK6_U_rel_ladder2_8: ULN9.15(C3) ; sheet U_rel_ladder7/R6
NetK6_U_rel_ladder3_8: ULN8.15(C3) ; sheet U_rel_ladder6/R6
NetK6_U_rel_ladder4_8: ULN7.12(C6) ; sheet U_rel_ladder5/R6
NetK6_U_rel_ladder5_8: ULN6.12(C6) ; sheet U_rel_ladder4/R6
NetK6_U_rel_ladder6_8: ULN4.12(C6) ; sheet U_rel_ladder2/R6
NetK6_U_rel_ladder7_8: ULN3.12(C6) ; sheet U_rel_ladder1/R6
NetK6_U_rel_ladder9#1_8: ULN5.12(C6) ; sheet U_rel_ladder3/R6
NetK6_U_rel_ladder9#2_8: ULN11.15(C3) ; sheet U_rel_ladder9/R6
NetK6_U_rel_ladder10#2_8: ULN12.15(C3) ; sheet U_rel_ladder10/R6
NetK7_U_rel_ladder1_8: ULN10.16(C2) ; sheet U_rel_ladder8/R7
NetK7_U_rel_ladder2_8: ULN9.16(C2) ; sheet U_rel_ladder7/R7
NetK7_U_rel_ladder3_8: ULN8.16(C2) ; sheet U_rel_ladder6/R7
NetK7_U_rel_ladder4_8: ULN7.11(C7) ; sheet U_rel_ladder5/R7
NetK7_U_rel_ladder5_8: ULN6.11(C7) ; sheet U_rel_ladder4/R7
NetK7_U_rel_ladder6_8: ULN4.11(C7) ; sheet U_rel_ladder2/R7
NetK7_U_rel_ladder7_8: ULN3.11(C7) ; sheet U_rel_ladder1/R7
NetK7_U_rel_ladder9#1_8: ULN5.11(C7) ; sheet U_rel_ladder3/R7
NetK7_U_rel_ladder9#2_8: ULN11.16(C2) ; sheet U_rel_ladder9/R7
NetK7_U_rel_ladder10#2_8: ULN12.16(C2) ; sheet U_rel_ladder10/R7
NetK8_U_rel_ladder1_8: ULN10.17(C1) ; sheet U_rel_ladder8/R8
NetK8_U_rel_ladder2_8: ULN9.17(C1) ; sheet U_rel_ladder7/R8
NetK8_U_rel_ladder3_8: ULN8.17(C1) ; sheet U_rel_ladder6/R8
NetK8_U_rel_ladder4_8: ULN7.10(C8) ; sheet U_rel_ladder5/R8
NetK8_U_rel_ladder5_8: ULN6.10(C8) ; sheet U_rel_ladder4/R8
NetK8_U_rel_ladder6_8: ULN4.10(C8) ; sheet U_rel_ladder2/R8
NetK8_U_rel_ladder7_8: ULN3.10(C8) ; sheet U_rel_ladder1/R8
NetK8_U_rel_ladder9#1_8: ULN5.10(C8) ; sheet U_rel_ladder3/R8
NetK8_U_rel_ladder9#2_8: ULN11.17(C1) ; sheet U_rel_ladder9/R8
NetK8_U_rel_ladder10#2_8: ULN12.17(C1) ; sheet U_rel_ladder10/R8
NetMCP2_1: MCP2.1(GPB4) ULN4.2(B4)
NetMCP2_2: MCP2.2(GPB5) ULN4.1(B3)
NetMCP2_3: MCP2.3(GPB6) ULN4.20(B2)
NetMCP2_4: MCP2.4(GPB7) ULN4.19(B1)
NetMCP2_17: MCP2.17(GPA0) ULN3.6(B8)
NetMCP2_18: MCP2.18(GPA1) ULN3.5(B7)
NetMCP2_19: MCP2.19(GPA2) ULN3.4(B6)
NetMCP2_20: MCP2.20(GPA3) ULN3.3(B5)
NetMCP2_21: MCP2.21(GPA4) ULN3.2(B4)
NetMCP2_22: MCP2.22(GPA5) ULN3.1(B3)
NetMCP2_23: MCP2.23(GPA6) ULN3.20(B2)
NetMCP2_24: MCP2.24(GPA7) ULN3.19(B1)
NetMCP2_25: MCP2.25(GPB0) ULN4.6(B8)
NetMCP2_26: MCP2.26(GPB1) ULN4.5(B7)
NetMCP2_27: MCP2.27(GPB2) ULN4.4(B6)
NetMCP2_28: MCP2.28(GPB3) ULN4.3(B5)
NetMCP3_1: MCP3.1(GPB4) ULN6.2(B4)
NetMCP3_2: MCP3.2(GPB5) ULN6.1(B3)
NetMCP3_3: MCP3.3(GPB6) ULN6.20(B2)
NetMCP3_4: MCP3.4(GPB7) ULN6.19(B1)
NetMCP3_17: MCP3.17(GPA0) ULN5.6(B8)
NetMCP3_18: MCP3.18(GPA1) ULN5.5(B7)
NetMCP3_19: MCP3.19(GPA2) ULN5.4(B6)
NetMCP3_20: MCP3.20(GPA3) ULN5.3(B5)
NetMCP3_21: MCP3.21(GPA4) ULN5.2(B4)
NetMCP3_22: MCP3.22(GPA5) ULN5.1(B3)
NetMCP3_23: MCP3.23(GPA6) ULN5.20(B2)
NetMCP3_24: MCP3.24(GPA7) ULN5.19(B1)
NetMCP3_25: MCP3.25(GPB0) ULN6.6(B8)
NetMCP3_26: MCP3.26(GPB1) ULN6.5(B7)
NetMCP3_27: MCP3.27(GPB2) ULN6.4(B6)
NetMCP3_28: MCP3.28(GPB3) ULN6.3(B5)
NetMCP4_1: MCP4.1(GPB4) ULN7.2(B4)
NetMCP4_2: MCP4.2(GPB5) ULN7.1(B3)
NetMCP4_3: MCP4.3(GPB6) ULN7.20(B2)
NetMCP4_4: MCP4.4(GPB7) ULN7.19(B1)
NetMCP4_17: MCP4.17(GPA0) ULN8.6(B8)
NetMCP4_18: MCP4.18(GPA1) ULN8.5(B7)
NetMCP4_19: MCP4.19(GPA2) ULN8.4(B6)
NetMCP4_20: MCP4.20(GPA3) ULN8.3(B5)
NetMCP4_21: MCP4.21(GPA4) ULN8.2(B4)
NetMCP4_22: MCP4.22(GPA5) ULN8.1(B3)
NetMCP4_23: MCP4.23(GPA6) ULN8.20(B2)
NetMCP4_24: MCP4.24(GPA7) ULN8.19(B1)
NetMCP4_25: MCP4.25(GPB0) ULN7.6(B8)
NetMCP4_26: MCP4.26(GPB1) ULN7.5(B7)
NetMCP4_27: MCP4.27(GPB2) ULN7.4(B6)
NetMCP4_28: MCP4.28(GPB3) ULN7.3(B5)
NetMCP5_1: MCP5.1(GPB4) ULN9.2(B4)
NetMCP5_2: MCP5.2(GPB5) ULN9.1(B3)
NetMCP5_3: MCP5.3(GPB6) ULN9.20(B2)
NetMCP5_4: MCP5.4(GPB7) ULN9.19(B1)
NetMCP5_17: MCP5.17(GPA0) ULN10.6(B8)
NetMCP5_18: MCP5.18(GPA1) ULN10.5(B7)
NetMCP5_19: MCP5.19(GPA2) ULN10.4(B6)
NetMCP5_20: MCP5.20(GPA3) ULN10.3(B5)
NetMCP5_21: MCP5.21(GPA4) ULN10.2(B4)
NetMCP5_22: MCP5.22(GPA5) ULN10.1(B3)
NetMCP5_23: MCP5.23(GPA6) ULN10.20(B2)
NetMCP5_24: MCP5.24(GPA7) ULN10.19(B1)
NetMCP5_25: MCP5.25(GPB0) ULN9.6(B8)
NetMCP5_26: MCP5.26(GPB1) ULN9.5(B7)
NetMCP5_27: MCP5.27(GPB2) ULN9.4(B6)
NetMCP5_28: MCP5.28(GPB3) ULN9.3(B5)
NetMCP6_1: MCP6.1(GPB4) ULN11.2(B4)
NetMCP6_2: MCP6.2(GPB5) ULN11.1(B3)
NetMCP6_3: MCP6.3(GPB6) ULN11.20(B2)
NetMCP6_4: MCP6.4(GPB7) ULN11.19(B1)
NetMCP6_17: MCP6.17(GPA0) ULN12.6(B8)
NetMCP6_18: MCP6.18(GPA1) ULN12.5(B7)
NetMCP6_19: MCP6.19(GPA2) ULN12.4(B6)
NetMCP6_20: MCP6.20(GPA3) ULN12.3(B5)
NetMCP6_21: MCP6.21(GPA4) ULN12.2(B4)
NetMCP6_22: MCP6.22(GPA5) ULN12.1(B3)
NetMCP6_23: MCP6.23(GPA6) ULN12.20(B2)
NetMCP6_24: MCP6.24(GPA7) ULN12.19(B1)
NetMCP6_25: MCP6.25(GPB0) ULN11.6(B8)
NetMCP6_26: MCP6.26(GPB1) ULN11.5(B7)
NetMCP6_27: MCP6.27(GPB2) ULN11.4(B6)
NetMCP6_28: MCP6.28(GPB3) ULN11.3(B5)
NetR30_2: R30.2 U2.12(PB2_(~{SS}/OC1B/PCINT2))
NetR31_2: R31.2 U2.13(PB3_(MOSI/PCINT3))
NetR32_2: R32.2 U2.15(PB5_(SCK/PCINT5))
NetR33_2: R33.2 U2.6(PB7_(PCINT7))

Not connected (* = marked no-connect by the designer): LD2 4(N/C)*; MCP2 15(INTB)* 16(INTA)*; MCP3 15(INTB)* 16(INTA)*; MCP4 15(INTB)* 16(INTA)*; MCP5 15(INTB)* 16(INTA)*; MCP6 15(INTB)* 16(INTA)*; U2 1(PD3_(PCINT19/INT1)) 2(PD4_(PCINT20/T0)) 5(PB6_(PCINT6/CLKI)) 7(PD5_(PCINT21/T1)) 8(PD6_(PCINT22/AIN0)) 9(PD7_(PCINT23/AIN1)) 10(PB0_(PCINT0/CLKO/ICP1)) 11(PB1_(OC1A/PCINT1)) 17(PC7_(PCINT15)) 19(PC0_(ADC0/PCINT8)) 20(PC1_(ADC1/PCINT9)) 21(PC2_(ADC2/PCINT10)) 22(PC3_(ADC3/PCINT11)) 26(PD0_(PCINT16)) 27(PD1_(PCINT17)) 28(PD2_(PCINT18/INT0))

### Library data of the parts
C10-C34 = C: Capacitor
C?#1 C?#2 = C+: Capacitor Polarized
J4 = JMP_mini
P5 P6 = Header 10X2: Header, 10-Pin, Dual row; LatestRevisionDate: 17-Jul-2002; LatestRevisionNote: Re-released for DXP Platform.; Publisher: Altium Limited
P7 P8 = Header 4: Header, 4-Pin; LatestRevisionDate: 17-Jul-2002; LatestRevisionNote: Re-released for DXP Platform.; Publisher: Altium Limited
P9 P10 = Header 6X2: Header, 6-Pin, Dual row; LatestRevisionDate: 17-Jul-2002; LatestRevisionNote: Re-released for DXP Platform.; Publisher: Altium Limited
R26-R38 = R
U2 = ATtiny88-MMU: as U1 on sheet POT 2x8; Published: 1-Apr-2010; DatasheetVersion: revC, Mar-2009; PackageVersion: revB, Nov-2008; PackageReference: 28M1; Publisher: Altium Limited; PackageDescription: 28-pad, 4x4x1.0mm Body, Pitch 0.45mm, 2.4x2.4mm Exposed Pad, Plastic Very Thin QFN Package (VQFN); Supplier 1: Digi-Key; Supplier Part Number 1: ATTINY88-MMU-ND; Supplier 2: Mouser; Supplier Part Number 2: 556-ATTINY88-MMU; ComponentLink1Description: Manufacturer Link; ComponentLink1URL: http://www.atmel.com/products/avr/default.asp?; ComponentLink2Description: ATtiny48/88 Datasheet; ComponentLink2URL: http://www.atmel.com/dyn/resources/prod_documents/doc8008.pdf; ComponentLink3Description: ATtiny48/88 Summary; ComponentLink3URL: http://www.atmel.com/dyn/resources/prod_documents/8008S.pdf; ComponentLink4Description: Atmel.com Home; ComponentLink4URL: http://www.atmel.com

## Nets that join several sheets
+3.3V: POT 2x8 (13 pins), POT 10x8 (30 pins)
+5: POT 2x8 (5 pins), POT 10x8 (6 pins)
+12: POT 2x8 (6 pins), U_rel_ladder 1 (8 pins), U_rel_ladder 2 (8 pins), POT 10x8 (23 pins), U_rel_ladder1 (8 pins), U_rel_ladder2 (8 pins), U_rel_ladder3 (8 pins), U_rel_ladder4 (8 pins), U_rel_ladder5 (8 pins), U_rel_ladder6 (8 pins), U_rel_ladder7 (8 pins), U_rel_ladder8 (8 pins), U_rel_ladder9 (8 pins), U_rel_ladder10 (8 pins)
AVCC: POT 2x8 (C9.1 FB1.2 U1.16), POT 10x8 (C33.1 FB2.2 U2.16)
GND: POT 2x8 (39 pins), POT 10x8 (82 pins)
A1: POT 2x8 (CN1.1), U_rel_ladder 2 (K8_U_rel_ladder8.6 R1_U_rel_ladder8.1)
A1: POT 10x8 (P5.3), U_rel_ladder1 (K8_U_rel_ladder7.6 R1_U_rel_ladder7.1)
A2: POT 2x8 (CN2.1), U_rel_ladder 1 (K8_U_rel_ladder10#1.6 R1_U_rel_ladder10#1.1)
A2: POT 10x8 (P5.7), U_rel_ladder2 (K8_U_rel_ladder6.6 R1_U_rel_ladder6.1)
A3: POT 10x8 (P5.11), U_rel_ladder3 (K8_U_rel_ladder9#1.6 R1_U_rel_ladder9#1.1)
A4: POT 10x8 (P5.15), U_rel_ladder4 (K8_U_rel_ladder5.6 R1_U_rel_ladder5.1)
A5: POT 10x8 (P5.19), U_rel_ladder5 (K8_U_rel_ladder4.6 R1_U_rel_ladder4.1)
A6: POT 10x8 (P6.17), U_rel_ladder6 (K8_U_rel_ladder3.6 R1_U_rel_ladder3.1)
A7: POT 10x8 (P6.13), U_rel_ladder7 (K8_U_rel_ladder2.6 R1_U_rel_ladder2.1)
A8: POT 10x8 (P6.9), U_rel_ladder8 (K8_U_rel_ladder1.6 R1_U_rel_ladder1.1)
A9: POT 10x8 (P6.5), U_rel_ladder9 (K8_U_rel_ladder9#2.6 R1_U_rel_ladder9#2.1)
A10: POT 10x8 (P6.1), U_rel_ladder10 (K8_U_rel_ladder10#2.6 R1_U_rel_ladder10#2.1)
B1: POT 2x8 (CN1.2 TP1.1), U_rel_ladder 2 (6 pins)
B1: POT 10x8 (P5.2 TP3.1), U_rel_ladder1 (6 pins)
B2: POT 2x8 (CN2.2 TP2.1), U_rel_ladder 1 (6 pins)
B2: POT 10x8 (P5.6 TP4.1), U_rel_ladder2 (6 pins)
B3: POT 10x8 (P5.10 TP5.1), U_rel_ladder3 (6 pins)
B4: POT 10x8 (P5.14 TP6.1), U_rel_ladder4 (6 pins)
B5: POT 10x8 (P5.18 TP7.1), U_rel_ladder5 (6 pins)
B6: POT 10x8 (P6.18 TP8.1), U_rel_ladder6 (6 pins)
B7: POT 10x8 (P6.14 TP9.1), U_rel_ladder7 (6 pins)
B8: POT 10x8 (P6.10 TP10.1), U_rel_ladder8 (6 pins)
B9: POT 10x8 (P6.6 TP11.1), U_rel_ladder9 (6 pins)
B10: POT 10x8 (P6.2 TP12.1), U_rel_ladder10 (6 pins)
C1: POT 2x8 (CN1.3), U_rel_ladder 2 (K8_U_rel_ladder8.4 R2_U_rel_ladder8.1)
C1: POT 10x8 (P5.1), U_rel_ladder1 (K8_U_rel_ladder7.4 R2_U_rel_ladder7.1)
C2: POT 2x8 (CN2.3), U_rel_ladder 1 (K8_U_rel_ladder10#1.4 R2_U_rel_ladder10#1.1)
C2: POT 10x8 (P5.5), U_rel_ladder2 (K8_U_rel_ladder6.4 R2_U_rel_ladder6.1)
C3: POT 10x8 (P5.9), U_rel_ladder3 (K8_U_rel_ladder9#1.4 R2_U_rel_ladder9#1.1)
C4: POT 10x8 (P5.13), U_rel_ladder4 (K8_U_rel_ladder5.4 R2_U_rel_ladder5.1)
C5: POT 10x8 (P5.17), U_rel_ladder5 (K8_U_rel_ladder4.4 R2_U_rel_ladder4.1)
C6: POT 10x8 (P6.19), U_rel_ladder6 (K8_U_rel_ladder3.4 R2_U_rel_ladder3.1)
C7: POT 10x8 (P6.15), U_rel_ladder7 (K8_U_rel_ladder2.4 R2_U_rel_ladder2.1)
C8: POT 10x8 (P6.11), U_rel_ladder8 (K8_U_rel_ladder1.4 R2_U_rel_ladder1.1)
C9: POT 10x8 (P6.7), U_rel_ladder9 (K8_U_rel_ladder9#2.4 R2_U_rel_ladder9#2.1)
C10: POT 10x8 (P6.3), U_rel_ladder10 (K8_U_rel_ladder10#2.4 R2_U_rel_ladder10#2.1)
NetK1_U_rel_ladder1_8: POT 10x8 (ULN10.10), U_rel_ladder8 (K1_U_rel_ladder1.8)
NetK1_U_rel_ladder2_8: POT 10x8 (ULN9.10), U_rel_ladder7 (K1_U_rel_ladder2.8)
NetK1_U_rel_ladder3_8: POT 10x8 (ULN8.10), U_rel_ladder6 (K1_U_rel_ladder3.8)
NetK1_U_rel_ladder4_8: POT 10x8 (ULN7.17), U_rel_ladder5 (K1_U_rel_ladder4.8)
NetK1_U_rel_ladder5_8: POT 10x8 (ULN6.17), U_rel_ladder4 (K1_U_rel_ladder5.8)
NetK1_U_rel_ladder6_8: POT 10x8 (ULN4.17), U_rel_ladder2 (K1_U_rel_ladder6.8)
NetK1_U_rel_ladder7_8: POT 10x8 (ULN3.17), U_rel_ladder1 (K1_U_rel_ladder7.8)
NetK1_U_rel_ladder8_8: POT 2x8 (ULN1.17), U_rel_ladder 2 (K1_U_rel_ladder8.8)
NetK1_U_rel_ladder9#1_8: POT 10x8 (ULN5.17), U_rel_ladder3 (K1_U_rel_ladder9#1.8)
NetK1_U_rel_ladder9#2_8: POT 10x8 (ULN11.10), U_rel_ladder9 (K1_U_rel_ladder9#2.8)
NetK1_U_rel_ladder10#1_8: POT 2x8 (ULN2.17), U_rel_ladder 1 (K1_U_rel_ladder10#1.8)
NetK1_U_rel_ladder10#2_8: POT 10x8 (ULN12.10), U_rel_ladder10 (K1_U_rel_ladder10#2.8)
NetK2_U_rel_ladder1_8: POT 10x8 (ULN10.11), U_rel_ladder8 (K2_U_rel_ladder1.8)
NetK2_U_rel_ladder2_8: POT 10x8 (ULN9.11), U_rel_ladder7 (K2_U_rel_ladder2.8)
NetK2_U_rel_ladder3_8: POT 10x8 (ULN8.11), U_rel_ladder6 (K2_U_rel_ladder3.8)
NetK2_U_rel_ladder4_8: POT 10x8 (ULN7.16), U_rel_ladder5 (K2_U_rel_ladder4.8)
NetK2_U_rel_ladder5_8: POT 10x8 (ULN6.16), U_rel_ladder4 (K2_U_rel_ladder5.8)
NetK2_U_rel_ladder6_8: POT 10x8 (ULN4.16), U_rel_ladder2 (K2_U_rel_ladder6.8)
NetK2_U_rel_ladder7_8: POT 10x8 (ULN3.16), U_rel_ladder1 (K2_U_rel_ladder7.8)
NetK2_U_rel_ladder8_8: POT 2x8 (ULN1.16), U_rel_ladder 2 (K2_U_rel_ladder8.8)
NetK2_U_rel_ladder9#1_8: POT 10x8 (ULN5.16), U_rel_ladder3 (K2_U_rel_ladder9#1.8)
NetK2_U_rel_ladder9#2_8: POT 10x8 (ULN11.11), U_rel_ladder9 (K2_U_rel_ladder9#2.8)
NetK2_U_rel_ladder10#1_8: POT 2x8 (ULN2.16), U_rel_ladder 1 (K2_U_rel_ladder10#1.8)
NetK2_U_rel_ladder10#2_8: POT 10x8 (ULN12.11), U_rel_ladder10 (K2_U_rel_ladder10#2.8)
NetK3_U_rel_ladder1_8: POT 10x8 (ULN10.12), U_rel_ladder8 (K3_U_rel_ladder1.8)
NetK3_U_rel_ladder2_8: POT 10x8 (ULN9.12), U_rel_ladder7 (K3_U_rel_ladder2.8)
NetK3_U_rel_ladder3_8: POT 10x8 (ULN8.12), U_rel_ladder6 (K3_U_rel_ladder3.8)
NetK3_U_rel_ladder4_8: POT 10x8 (ULN7.15), U_rel_ladder5 (K3_U_rel_ladder4.8)
NetK3_U_rel_ladder5_8: POT 10x8 (ULN6.15), U_rel_ladder4 (K3_U_rel_ladder5.8)
NetK3_U_rel_ladder6_8: POT 10x8 (ULN4.15), U_rel_ladder2 (K3_U_rel_ladder6.8)
NetK3_U_rel_ladder7_8: POT 10x8 (ULN3.15), U_rel_ladder1 (K3_U_rel_ladder7.8)
NetK3_U_rel_ladder8_8: POT 2x8 (ULN1.15), U_rel_ladder 2 (K3_U_rel_ladder8.8)
NetK3_U_rel_ladder9#1_8: POT 10x8 (ULN5.15), U_rel_ladder3 (K3_U_rel_ladder9#1.8)
NetK3_U_rel_ladder9#2_8: POT 10x8 (ULN11.12), U_rel_ladder9 (K3_U_rel_ladder9#2.8)
NetK3_U_rel_ladder10#1_8: POT 2x8 (ULN2.15), U_rel_ladder 1 (K3_U_rel_ladder10#1.8)
NetK3_U_rel_ladder10#2_8: POT 10x8 (ULN12.12), U_rel_ladder10 (K3_U_rel_ladder10#2.8)
NetK4_U_rel_ladder1_8: POT 10x8 (ULN10.13), U_rel_ladder8 (K4_U_rel_ladder1.8)
NetK4_U_rel_ladder2_8: POT 10x8 (ULN9.13), U_rel_ladder7 (K4_U_rel_ladder2.8)
NetK4_U_rel_ladder3_8: POT 10x8 (ULN8.13), U_rel_ladder6 (K4_U_rel_ladder3.8)
NetK4_U_rel_ladder4_8: POT 10x8 (ULN7.14), U_rel_ladder5 (K4_U_rel_ladder4.8)
NetK4_U_rel_ladder5_8: POT 10x8 (ULN6.14), U_rel_ladder4 (K4_U_rel_ladder5.8)
NetK4_U_rel_ladder6_8: POT 10x8 (ULN4.14), U_rel_ladder2 (K4_U_rel_ladder6.8)
NetK4_U_rel_ladder7_8: POT 10x8 (ULN3.14), U_rel_ladder1 (K4_U_rel_ladder7.8)
NetK4_U_rel_ladder8_8: POT 2x8 (ULN1.14), U_rel_ladder 2 (K4_U_rel_ladder8.8)
NetK4_U_rel_ladder9#1_8: POT 10x8 (ULN5.14), U_rel_ladder3 (K4_U_rel_ladder9#1.8)
NetK4_U_rel_ladder9#2_8: POT 10x8 (ULN11.13), U_rel_ladder9 (K4_U_rel_ladder9#2.8)
NetK4_U_rel_ladder10#1_8: POT 2x8 (ULN2.14), U_rel_ladder 1 (K4_U_rel_ladder10#1.8)
NetK4_U_rel_ladder10#2_8: POT 10x8 (ULN12.13), U_rel_ladder10 (K4_U_rel_ladder10#2.8)
NetK5_U_rel_ladder1_8: POT 10x8 (ULN10.14), U_rel_ladder8 (K5_U_rel_ladder1.8)
NetK5_U_rel_ladder2_8: POT 10x8 (ULN9.14), U_rel_ladder7 (K5_U_rel_ladder2.8)
NetK5_U_rel_ladder3_8: POT 10x8 (ULN8.14), U_rel_ladder6 (K5_U_rel_ladder3.8)
NetK5_U_rel_ladder4_8: POT 10x8 (ULN7.13), U_rel_ladder5 (K5_U_rel_ladder4.8)
NetK5_U_rel_ladder5_8: POT 10x8 (ULN6.13), U_rel_ladder4 (K5_U_rel_ladder5.8)
NetK5_U_rel_ladder6_8: POT 10x8 (ULN4.13), U_rel_ladder2 (K5_U_rel_ladder6.8)
NetK5_U_rel_ladder7_8: POT 10x8 (ULN3.13), U_rel_ladder1 (K5_U_rel_ladder7.8)
NetK5_U_rel_ladder8_8: POT 2x8 (ULN1.13), U_rel_ladder 2 (K5_U_rel_ladder8.8)
NetK5_U_rel_ladder9#1_8: POT 10x8 (ULN5.13), U_rel_ladder3 (K5_U_rel_ladder9#1.8)
NetK5_U_rel_ladder9#2_8: POT 10x8 (ULN11.14), U_rel_ladder9 (K5_U_rel_ladder9#2.8)
NetK5_U_rel_ladder10#1_8: POT 2x8 (ULN2.13), U_rel_ladder 1 (K5_U_rel_ladder10#1.8)
NetK5_U_rel_ladder10#2_8: POT 10x8 (ULN12.14), U_rel_ladder10 (K5_U_rel_ladder10#2.8)
NetK6_U_rel_ladder1_8: POT 10x8 (ULN10.15), U_rel_ladder8 (K6_U_rel_ladder1.8)
NetK6_U_rel_ladder2_8: POT 10x8 (ULN9.15), U_rel_ladder7 (K6_U_rel_ladder2.8)
NetK6_U_rel_ladder3_8: POT 10x8 (ULN8.15), U_rel_ladder6 (K6_U_rel_ladder3.8)
NetK6_U_rel_ladder4_8: POT 10x8 (ULN7.12), U_rel_ladder5 (K6_U_rel_ladder4.8)
NetK6_U_rel_ladder5_8: POT 10x8 (ULN6.12), U_rel_ladder4 (K6_U_rel_ladder5.8)
NetK6_U_rel_ladder6_8: POT 10x8 (ULN4.12), U_rel_ladder2 (K6_U_rel_ladder6.8)
NetK6_U_rel_ladder7_8: POT 10x8 (ULN3.12), U_rel_ladder1 (K6_U_rel_ladder7.8)
NetK6_U_rel_ladder8_8: POT 2x8 (ULN1.12), U_rel_ladder 2 (K6_U_rel_ladder8.8)
NetK6_U_rel_ladder9#1_8: POT 10x8 (ULN5.12), U_rel_ladder3 (K6_U_rel_ladder9#1.8)
NetK6_U_rel_ladder9#2_8: POT 10x8 (ULN11.15), U_rel_ladder9 (K6_U_rel_ladder9#2.8)
NetK6_U_rel_ladder10#1_8: POT 2x8 (ULN2.12), U_rel_ladder 1 (K6_U_rel_ladder10#1.8)
NetK6_U_rel_ladder10#2_8: POT 10x8 (ULN12.15), U_rel_ladder10 (K6_U_rel_ladder10#2.8)
NetK7_U_rel_ladder1_8: POT 10x8 (ULN10.16), U_rel_ladder8 (K7_U_rel_ladder1.8)
NetK7_U_rel_ladder2_8: POT 10x8 (ULN9.16), U_rel_ladder7 (K7_U_rel_ladder2.8)
NetK7_U_rel_ladder3_8: POT 10x8 (ULN8.16), U_rel_ladder6 (K7_U_rel_ladder3.8)
NetK7_U_rel_ladder4_8: POT 10x8 (ULN7.11), U_rel_ladder5 (K7_U_rel_ladder4.8)
NetK7_U_rel_ladder5_8: POT 10x8 (ULN6.11), U_rel_ladder4 (K7_U_rel_ladder5.8)
NetK7_U_rel_ladder6_8: POT 10x8 (ULN4.11), U_rel_ladder2 (K7_U_rel_ladder6.8)
NetK7_U_rel_ladder7_8: POT 10x8 (ULN3.11), U_rel_ladder1 (K7_U_rel_ladder7.8)
NetK7_U_rel_ladder8_8: POT 2x8 (ULN1.11), U_rel_ladder 2 (K7_U_rel_ladder8.8)
NetK7_U_rel_ladder9#1_8: POT 10x8 (ULN5.11), U_rel_ladder3 (K7_U_rel_ladder9#1.8)
NetK7_U_rel_ladder9#2_8: POT 10x8 (ULN11.16), U_rel_ladder9 (K7_U_rel_ladder9#2.8)
NetK7_U_rel_ladder10#1_8: POT 2x8 (ULN2.11), U_rel_ladder 1 (K7_U_rel_ladder10#1.8)
NetK7_U_rel_ladder10#2_8: POT 10x8 (ULN12.16), U_rel_ladder10 (K7_U_rel_ladder10#2.8)
NetK8_U_rel_ladder1_8: POT 10x8 (ULN10.17), U_rel_ladder8 (K8_U_rel_ladder1.8)
NetK8_U_rel_ladder2_8: POT 10x8 (ULN9.17), U_rel_ladder7 (K8_U_rel_ladder2.8)
NetK8_U_rel_ladder3_8: POT 10x8 (ULN8.17), U_rel_ladder6 (K8_U_rel_ladder3.8)
NetK8_U_rel_ladder4_8: POT 10x8 (ULN7.10), U_rel_ladder5 (K8_U_rel_ladder4.8)
NetK8_U_rel_ladder5_8: POT 10x8 (ULN6.10), U_rel_ladder4 (K8_U_rel_ladder5.8)
NetK8_U_rel_ladder6_8: POT 10x8 (ULN4.10), U_rel_ladder2 (K8_U_rel_ladder6.8)
NetK8_U_rel_ladder7_8: POT 10x8 (ULN3.10), U_rel_ladder1 (K8_U_rel_ladder7.8)
NetK8_U_rel_ladder8_8: POT 2x8 (ULN1.10), U_rel_ladder 2 (K8_U_rel_ladder8.8)
NetK8_U_rel_ladder9#1_8: POT 10x8 (ULN5.10), U_rel_ladder3 (K8_U_rel_ladder9#1.8)
NetK8_U_rel_ladder9#2_8: POT 10x8 (ULN11.17), U_rel_ladder9 (K8_U_rel_ladder9#2.8)
NetK8_U_rel_ladder10#1_8: POT 2x8 (ULN2.10), U_rel_ladder 1 (K8_U_rel_ladder10#1.8)
NetK8_U_rel_ladder10#2_8: POT 10x8 (ULN12.17), U_rel_ladder10 (K8_U_rel_ladder10#2.8)